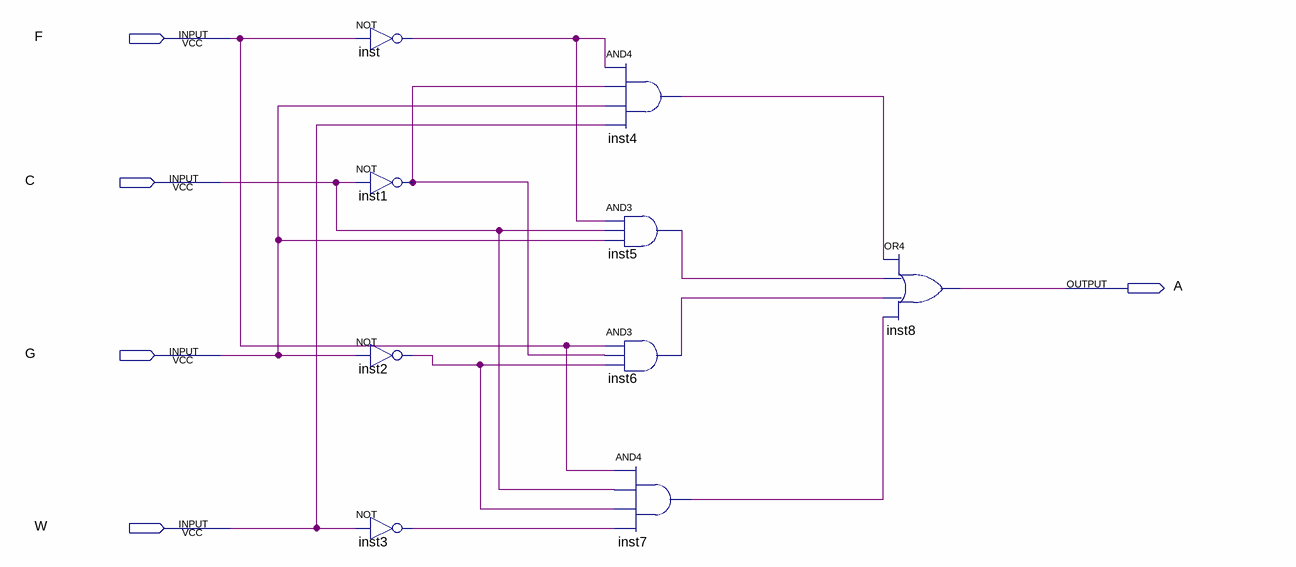
[diagram p0: schematic sheet]
// Quartus schematic lab3step3.bdf as structural Verilog: 9 symbols, 5 pins
module lab3step3 (
  input  F,
  input  C,
  input  G,
  input  W,
  output A
);

  wire inst1_out, inst2_out, inst3_out, inst4_out, inst5_out, inst6_out, inst7_out, inst_out;

  not inst (inst_out, F);
  not inst1 (inst1_out, C);
  not inst2 (inst2_out, G);
  not inst3 (inst3_out, W);
  and inst4 (inst4_out, inst_out, inst1_out, G, W);
  and inst5 (inst5_out, inst_out, C, G);
  and inst6 (inst6_out, F, inst1_out, inst2_out);
  and inst7 (inst7_out, F, C, inst2_out, inst3_out);
  or inst8 (A, inst4_out, inst5_out, inst6_out, inst7_out);
endmodule
